# EAGLE design ConnectorHolderPCB_V0.3 (EAGLE 9.5.2)
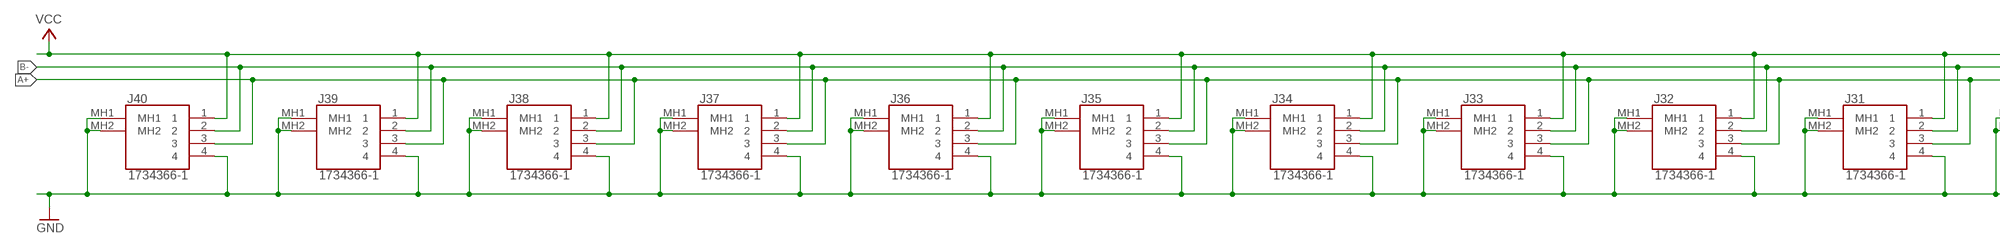
[diagram p0: schematic, sheet 1, part 1 of 2]
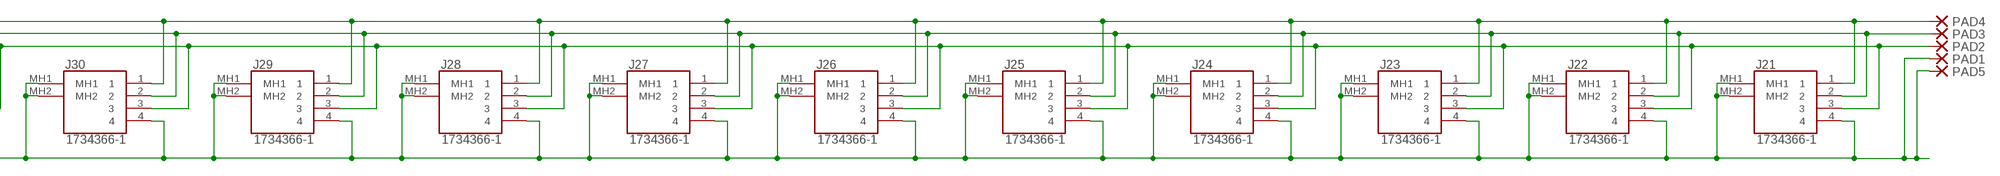
[diagram p1: schematic, sheet 1, part 2 of 2]

## Parts
J21  1734366-1  [17343661]
J22  1734366-1  [17343661]
J23  1734366-1  [17343661]
J24  1734366-1  [17343661]
J25  1734366-1  [17343661]
J26  1734366-1  [17343661]
J27  1734366-1  [17343661]
J28  1734366-1  [17343661]
J29  1734366-1  [17343661]
J30  1734366-1  [17343661]
J31  1734366-1  [17343661]
J32  1734366-1  [17343661]
J33  1734366-1  [17343661]
J34  1734366-1  [17343661]
J35  1734366-1  [17343661]
J36  1734366-1  [17343661]
J37  1734366-1  [17343661]
J38  1734366-1  [17343661]
J39  1734366-1  [17343661]
J40  1734366-1  [17343661]
PAD1  SMD2  [SMD1,27-2,54]
PAD2  SMD2  [SMD1,27-2,54]
PAD3  SMD2  [SMD1,27-2,54]
PAD4  SMD2  [SMD1,27-2,54]
PAD5  SMD2  [SMD1,27-2,54]

## Nets
A+: J21.3 J22.3 J23.3 J24.3 J25.3 J26.3 J27.3 J28.3 J29.3 J30.3 J31.3 J32.3 J33.3 J34.3 J35.3 J36.3 J37.3 J38.3 J39.3 J40.3 PAD2.1(P)
B-: J21.2 J22.2 J23.2 J24.2 J25.2 J26.2 J27.2 J28.2 J29.2 J30.2 J31.2 J32.2 J33.2 J34.2 J35.2 J36.2 J37.2 J38.2 J39.2 J40.2 PAD3.1(P)
GND: J21.4 J21.MH1 J21.MH2 J22.4 J22.MH1 J22.MH2 J23.4 J23.MH1 J23.MH2 J24.4 J24.MH1 J24.MH2 J25.4 J25.MH1 J25.MH2 J26.4 J26.MH1 J26.MH2 J27.4 J27.MH1 J27.MH2 J28.4 J28.MH1 J28.MH2 J29.4 J29.MH1 J29.MH2 J30.4 J30.MH1 J30.MH2 J31.4 J31.MH1 J31.MH2 J32.4 J32.MH1 J32.MH2 J33.4 J33.MH1 J33.MH2 J34.4 J34.MH1 J34.MH2 J35.4 J35.MH1 J35.MH2 J36.4 J36.MH1 J36.MH2 J37.4 J37.MH1 J37.MH2 J38.4 J38.MH1 J38.MH2 J39.4 J39.MH1 J39.MH2 J40.4 J40.MH1 J40.MH2 PAD1.1(P) PAD5.1(P)
VCC: J21.1 J22.1 J23.1 J24.1 J25.1 J26.1 J27.1 J28.1 J29.1 J30.1 J31.1 J32.1 J33.1 J34.1 J35.1 J36.1 J37.1 J38.1 J39.1 J40.1 PAD4.1(P)

## Library data of the parts
J21-J40 = SamacSys_Parts:1734366-1: USB Connectors 1PORT 4POS VERT T/H USB 2.0 BLACK Source: Datasheet <https://datasheet.lcsc.com/szlcsc/TE-Connectivity-1734366-1_C305910.pdf>; DESCRIPTION: USB Connectors 1PORT 4POS VERT T/H USB 2.0 BLACK; HEIGHT: 15mm; MANUFACTURER_NAME: TE Connectivity; MANUFACTURER_PART_NUMBER: 1734366-1; MOUSER_PART_NUMBER: 571-1734366-1; MOUSER_PRICE-STOCK: https://www.mouser.co.uk/ProductDetail/TE-Connectivity/1734366-1?qs=Y377PMEofyC1I8%2FZakOHrA%3D%3D
PAD1-PAD5 = wirepad:SMD2: SMD PAD

## Board
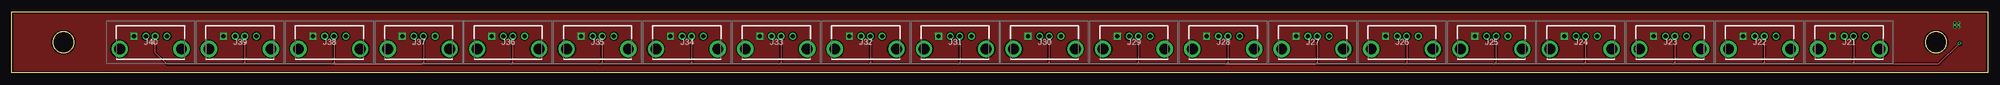
[diagram p2: board, top side]
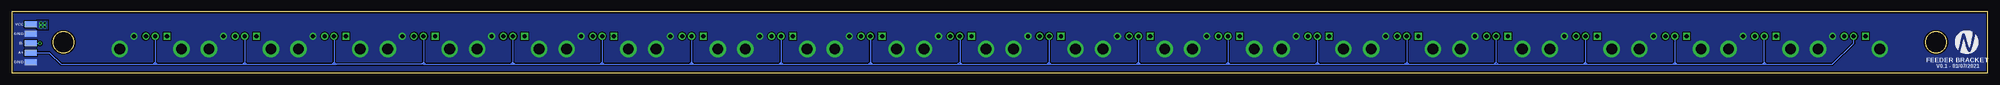
[diagram p3: board, bottom side, seen from below]

Size 420 x 13 mm. Coordinates in mm from the lower left corner, seen from the top.
Outline: 420,0 0,0 0,13 420,13 420,0
Outline: circle at 11,6.5 radius 2.2
Outline: circle at 409,6.5 radius 2.2
Copper layers (1*16): Top 0.035mm / dielectric 1.5mm / Bottom 0.035mm
Design rules "aisler_2_layer": minimum track width 0.1mm, minimum drill 0.2mm, track to track 0.15mm, track to pad 0.15mm, pad to pad 0.1mm, via to via 0.1mm, smd to smd 0.1mm, copper to edge 0.2mm, drill to drill 0.21mm, minimum pad ring 0.25mm, minimum via ring 0.15mm, stop-mask expansion 0mil, vias tented up to drill 0mil, thermal gap 10mil

### Footprints (pad centres in the part's own frame; a part is rotated, then mirrored left to right if it is on the bottom)
17343661 = drill 0.92 pad 1.431 square: 1 0,0 | drill 0.92 pad 1.431: 2 2.5,0; 3 4.5,0; 4 7,0 | drill 2.3 pad 3.45: MH1 -3.07,-2.71; MH2 10.07,-2.71
SMD1,27-2,54 = smd 1.27 x 2.54: 1 0,0

### Placement (x,y rotation side)
J21  387,7.8 0 top
J22  368,7.8 0 top
J23  349,7.8 0 top
J24  330,7.8 0 top
J25  311,7.8 0 top
J26  292,7.8 0 top
J27  273,7.8 0 top
J28  254,7.8 0 top
J29  235,7.8 0 top
J30  216,7.8 0 top
J31  197,7.8 0 top
J32  178,7.8 0 top
J33  159,7.8 0 top
J34  140,7.8 0 top
J35  121,7.8 0 top
J36  102,7.8 0 top
J37  83,7.8 0 top
J38  64,7.8 0 top
J39  45,7.8 0 top
J40  26,7.8 0 top
PAD1  416,8.3 90 bottom
PAD2  416,6.3 90 bottom
PAD3  416,4.3 90 bottom
PAD4  416,10.3 90 bottom
PAD5  416,2.3 270 bottom
U$1  [NPNP_LARGE_NOTEXT]  4.5,6.5 0 bottom

### Tracks (layer width: path | path; a pad name or v marks a point on that pad's centre or on a via)
A+  (via drill 0.35)
  Top 0.254: J40.3 30.5,4.3 33,1.8 49.08,1.8 | v414,6.3 409.5,1.8 391.5,1.8 | 391.5,1.8 391.1,1.8 | 391.1,1.8 372.5,1.8 | 372.5,1.8 372.08,1.8 | 372.08,1.8 353.5,1.8 | 353.5,1.8 334.5,1.8 | 334.5,1.8 315.5,1.8 | 315.5,1.8 296.5,1.8 | 296.5,1.8 277.5,1.8 | 277.5,1.8 277.08,1.8 | 258.5,1.8 277.08,1.8 | 258.5,1.8 258.3,1.8 | 258.08,1.8 239.5,1.8 | 239.08,1.8 220.5,1.8 | 220.5,1.8 220.08,1.8 | 220.08,1.8 201.5,1.8 | 201.5,1.8 182.92,1.8 | 182.92,1.8 182.5,1.8 | 182.5,1.8 182.1,1.8 | 182.1,1.8 163.5,1.8 | 163.5,1.8 163.08,1.8 | 163.08,1.8 144.5,1.8 | 144.5,1.8 144.08,1.8 | 144.08,1.8 125.5,1.8 | 125.5,1.8 125.08,1.8 | 125.08,1.8 106.5,1.8 | 106.5,1.8 106.1,1.8 | 106.1,1.8 87.5,1.8 | 87.5,1.8 87.1,1.8 | 68.5,1.8 87.1,1.8 | 68.5,1.8 68.08,1.8 | 68.08,1.8 49.49,1.8 | 49.49,1.8 49.08,1.8 | J21.3 391.5,2.22 | 391.5,2.22 391.5,2.2 | 391.5,2.2 391.5,1.8 | J22.3 372.5,2.22 | 372.5,2.22 372.5,1.8 | J23.3 353.5,2.22 | 353.5,2.22 353.5,1.8 | J24.3 334.5,2.22 | 334.5,2.22 334.5,1.8 | J25.3 315.5,2.2 | 315.5,2.2 315.5,1.8 | J26.3 296.5,2.22 | 296.5,2.22 296.5,1.8 | J27.3 277.5,1.8 | 220.5,1.8 J30.3 220.5,2.22 | 201.5,2.22 201.5,1.8 | J32.3 182.5,2.22 | 182.5,2.22 182.5,2.2 | 182.5,2.2 182.5,1.8 | J33.3 163.5,2.22 | 163.5,2.22 163.5,1.8 | J34.3 144.5,2.22 | 144.5,2.22 144.5,1.8 | J35.3 125.5,2.22 | 125.5,2.22 125.5,1.8 | J36.3 106.5,2.22 | 106.5,2.22 106.5,2.2 | 106.5,2.2 106.5,1.8 | J37.3 87.5,2.2 | 87.5,2.2 87.5,1.8 | J38.3 68.5,2.22 | 68.5,2.22 68.5,1.8 | J39.3 49.5,2.22 | 49.5,2.22 49.5,1.81 49.49,1.8 | 49.08,1.8 49.5,2.22 | 50,1.8 49.92,1.8 49.5,2.22 | 391.08,1.8 391.1,1.82 | 391.92,1.8 391.5,2.22 | 372.92,1.8 372.5,2.22 | 353.92,1.8 353.5,2.22 | 334.92,1.8 334.5,2.22 | 315.92,1.8 315.5,2.22 315.08,1.8 315.1,1.8 315.5,2.2 | 277.92,1.8 277.5,2.22 277.08,1.8
  Top 0.254: 258.08,1.8 258.5,2.22 258.92,1.8 | 239.92,1.8 239.5,2.22 239.08,1.8 | 220.92,1.8 220.5,2.22 | 201.08,1.8 201.5,2.22 | 201.92,1.8 201.5,2.22 | 182.5,2.22 182.08,1.8 182,1.8 | 163.92,1.8 163.5,2.22 | 144.92,1.8 144.5,2.22 | 125.92,1.8 125.5,2.22 | 106.92,1.8 106.5,2.22 | 87.08,1.8 87.39,2.11 | 87.39,2.11 87.5,2.22 87.92,1.8 | 68.92,1.8 68.5,2.22 | J31.3 201.5,2.22 | 220.5,2.22 220.08,1.8 | 239.5,1.8 239.08,1.8 | J29.3 239.5,1.8 | 258.5,2 258.5,1.8 | J28.3 258.5,2 | 258.08,1.8 258.3,1.8 | 258.3,1.8 258.5,2 | 296.92,1.8 296.5,2.22 | 296.08,1.8 296.5,2.22 | 334.08,1.8 334.5,2.22 | 353.08,1.8 353.5,2.22 | 372.08,1.8 372.5,2.22 | 391.5,2.2 391.1,1.8 | 391.1,1.8 391.1,1.82 | 391.1,1.82 391.5,2.22 | 163.08,1.8 163.5,2.22 | 144.08,1.8 144.5,2.22 | 125.08,1.8 125.5,2.22 | 106.1,1.8 106.5,2.2 | 106.08,1.8 106.5,2.22 | 87.39,2.09 87.5,2.2 | 87.1,1.8 87.39,2.09 | 87.39,2.09 87.39,2.11 | 68.08,1.8 68.5,2.22 | 182.1,1.8 182.5,2.2 | 182.92,1.8 182.5,2.22
  Bottom 0.254: PAD2.1 v414,6.3
B-
  Bottom 0.254: 389.51,1.8 409.5,1.8 412,4.3 PAD3.1 | 389.51,1.8 370.5,1.8 | 370.5,1.8 351.49,1.8 | 351.49,1.8 351.06,1.8 | 332.5,1.8 351.06,1.8 | 332.5,1.8 313.52,1.8 | 313.52,1.8 313.1,1.8 | 313.1,1.8 294.49,1.8 | 294.49,1.8 294.06,1.8 | 294.06,1.8 275.51,1.8 | 275.51,1.8 275.06,1.8 | 275.06,1.8 256.5,1.8 | 256.5,1.8 237.49,1.8 | 237.49,1.8 237.06,1.8 | 237.06,1.8 218.51,1.8 | 218.51,1.8 199.5,1.8 | 199.5,1.8 180.52,1.8 | 180.52,1.8 161.51,1.8 | 161.51,1.8 142.43,1.8 | 142.43,1.8 123.5,1.8 | 123.5,1.8 123.06,1.8 | 123.06,1.8 104.5,1.8 | 104.5,1.8 85.5,1.8 | 85.5,1.8 66.51,1.8 | 66.51,1.8 47.94,1.8 | 47.94,1.8 47.5,1.8 | 47.5,1.8 47.06,1.8 | 47.06,1.8 33,1.8 28.5,6.3 J40.2 | 47.5,1.8 47.5,2.24 | 47.5,2.24 J39.2 | J38.2 66.5,2.24 | 66.5,2.24 66.5,1.81 | 66.5,1.81 66.51,1.8 | J37.2 85.5,2.24 | J36.2 104.5,2.24 | J35.2 123.5,2.24 | J34.2 142.5,2.24 | 142.5,2.24 142.5,1.87 | 142.5,1.87 142.43,1.8 | J33.2 161.5,2.24 | 161.5,2.24 161.5,1.81 | 161.5,1.81 161.51,1.8 | J32.2 180.5,2.24 | 180.5,2.2 180.5,1.82 | 180.5,1.82 180.52,1.8 | J31.2 199.5,2.24 | J30.2 218.5,2.24 | 218.5,2.24 218.5,1.81 | 218.5,1.81 218.51,1.8 | J29.2 237.5,2.24 | 237.5,2.24 237.5,1.81 | 237.5,1.81 237.49,1.8 | J28.2 256.5,2.24 | J27.2 275.5,2.24 | 275.5,2.24 275.5,1.81 | 275.5,1.81 275.51,1.8 | J26.2 294.5,2.24 | 294.5,2.24 294.5,1.81 | 294.5,1.81 294.49,1.8 | J25.2 313.5,2.24 | 313.5,2.2 313.5,1.82 | 313.5,1.82 313.52,1.8 | J24.2 332.5,2.24 | J23.2 351.5,2.24 | 351.5,2.24 351.5,1.81 | 351.5,1.81 351.49,1.8 | J22.2 370.5,2.24 | 389.5,2.24 J21.2 389.51,1.8 | 389.5,2.24 389.5,1.81 | 389.5,1.81 389.51,1.8 | 47.06,1.8 47.5,2.24 | 47.5,2.24 47.94,1.8 | 389.5,1.81 389.5,1.8 | 389.5,2.24 389.94,1.8 | 370.5,1.8 370.5,2.24 | 370.06,1.8 370.5,2.24 | 370.5,2.24 370.94,1.8
  Bottom 0.254: 351.5,1.8 351.5,1.81 | 351.5,2.24 351.94,1.8 | 332.5,1.8 332.5,2.24 | 332.06,1.8 332.5,2.24 | 332.5,2.24 332.94,1.8 | 313.5,1.8 313.5,1.82 | 313.5,2.2 313.5,2.24 | 313.06,1.8 313.5,2.24 | 313.5,2.24 313.94,1.8 | 294.5,1.8 294.5,1.81 | 294.5,2.24 294.94,1.8 | 275.5,1.8 275.5,1.81 | 275.5,2.24 275.94,1.8 | 256.5,1.8 256.5,2.24 | 256.06,1.8 256.5,2.24 | 256.5,2.24 256.94,1.8 | 237.5,1.8 237.5,1.81 | 237.5,2.24 237.94,1.8 | 218.5,1.8 218.5,1.81 | 218.5,2.24 218.94,1.8 | 199.5,1.8 199.5,2.24 | 199.06,1.8 199.5,2.24 | 199.5,2.24 199.94,1.8 | 180.5,1.8 180.5,1.82 | 180.5,2.2 180.5,2.24 | 180.5,2.24 180.06,1.8 180.1,1.8 180.5,2.2 | 180.5,2.24 180.94,1.8 | 161.5,1.8 161.5,1.81 | 161.5,2.24 161.94,1.8 | 142.5,1.8 142.5,1.87 | 142.5,2.24 142.94,1.8 | 123.5,1.8 123.5,2.24 | 123.5,2.24 123.94,1.8 | 104.5,1.8 104.5,2.24 | 104.06,1.8 104.5,2.24 | 104.5,2.24 104.94,1.8 | 85.5,1.8 85.5,2.24 | 85.06,1.8 85.5,2.24 | 85.5,2.24 85.94,1.8 | 66.5,1.8 66.5,1.81 | 66.5,2.24 66.94,1.8 | 389.06,1.8 389.5,2.24 | 351.06,1.8 351.5,2.24 | 313.1,1.8 313.5,2.2 | 294.06,1.8 294.5,2.24 | 275.06,1.8 275.5,2.24 | 237.06,1.8 237.5,2.24 | 218.06,1.8 218.5,2.24 | 161.06,1.8 161.5,2.24 | 142.06,1.8 142.5,2.24 | 123.06,1.8 123.5,2.24 | 66.06,1.8 66.5,2.24
GND
  pour Bottom (isolate 0.254, rank 2, no thermals): -2,14.8 -2,-2.2 424,-2.2 424,14.8
VCC  (via drill 0.35)
  other vias: 413.8,9.8 413,9.8 413.8,10.6 413,10.6
  pour Top (isolate 0.254, rank 2, no thermals): -10,26.8 -10,-11.2 428,-11.2 428,26.8
  pour Bottom (no thermals): 415,10.04 415,10.58 414.48,11.1 412.5,11.1 412.5,9.3 414.26,9.3

### Text on the board
bPlace: VCC | GND | B- | A+ | FEEDER BRACKET | V0.1 - 01/07/2021 | GND